# Altium schematic sheet functions.SchDoc
size 594 x 420 mm; Нач. отд.: Нач. отд.; Фамилия нач. отд.: Сидоров; Address1: Address1; Address2: Address2; Address3: Address3; Address4: Address4; SheetNumber: 1; Scale: 1:1; Обозначение документа: АБВГ.123456.001Э3; Наименование организации: ОАО "Ваша фирма"; Перв. применение: АБВГ.123456.000; Наименование изделия 1: Плата; Наименование изделия 2: Схема электрическая; Наименование изделия 3: принципиальная
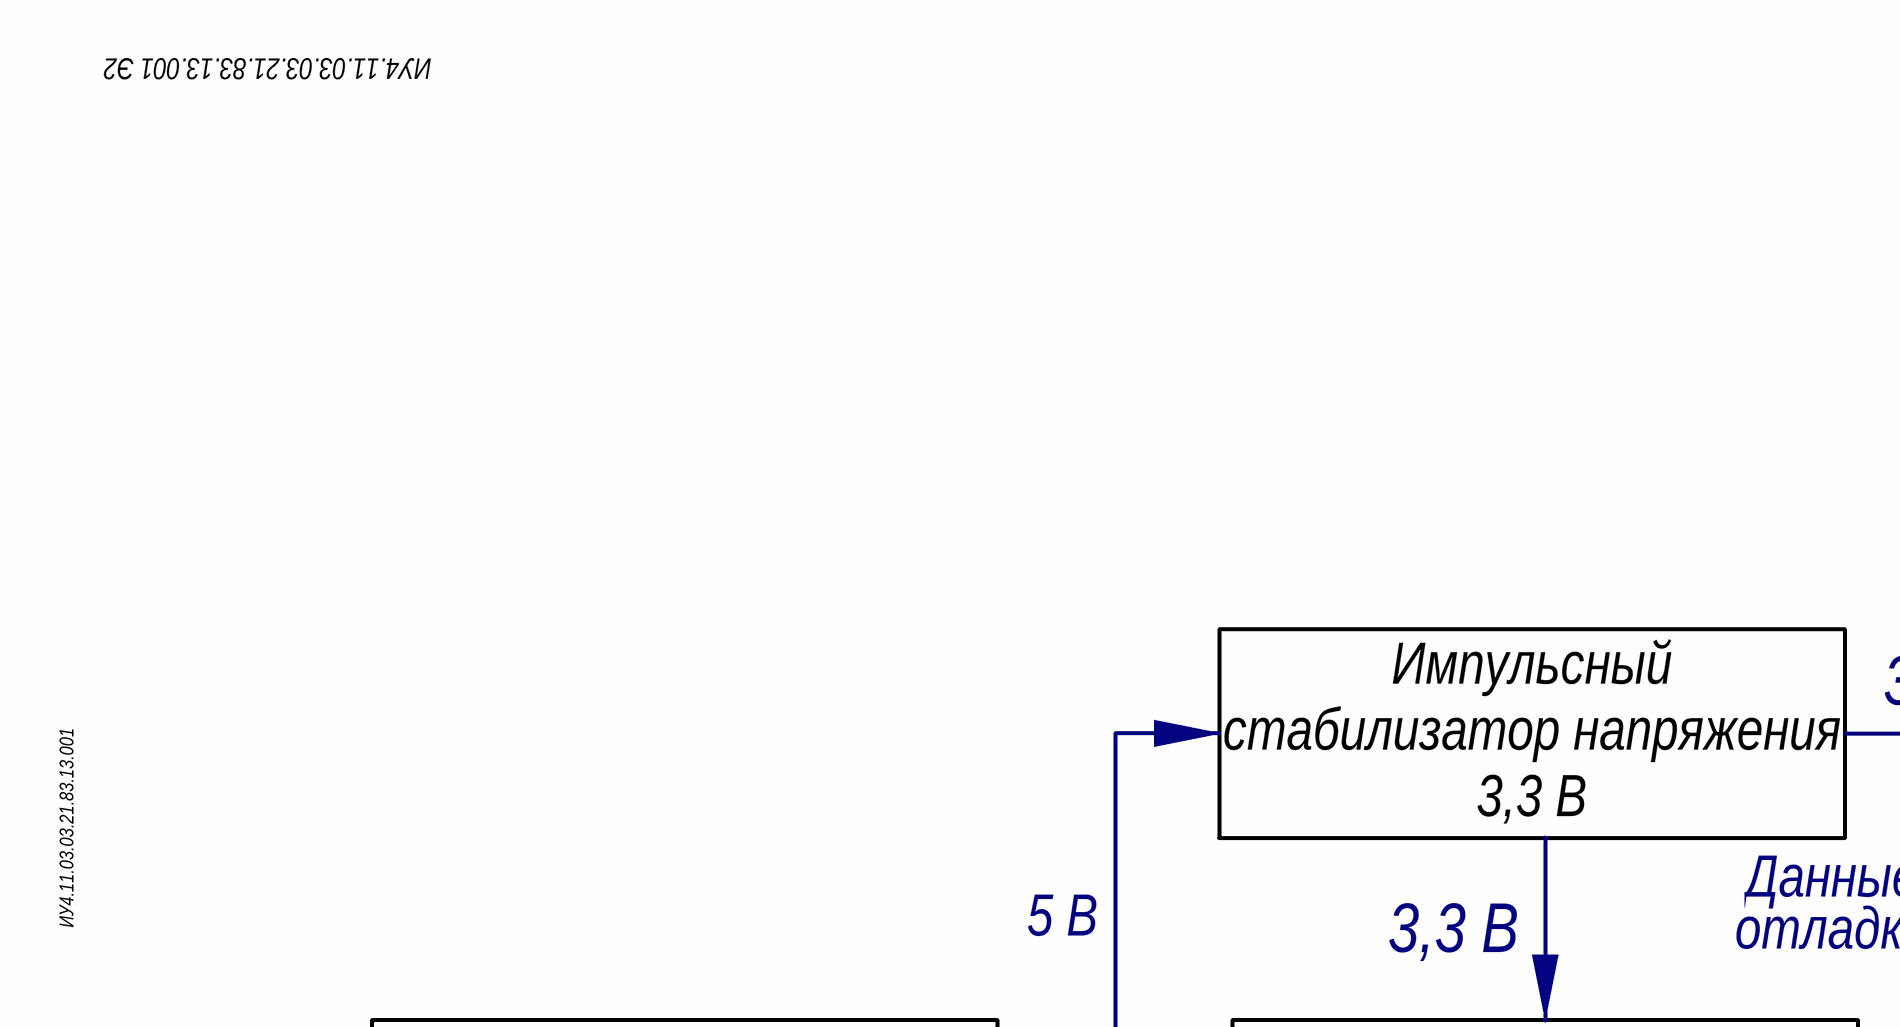
[diagram p0: functions.SchDoc, top left]
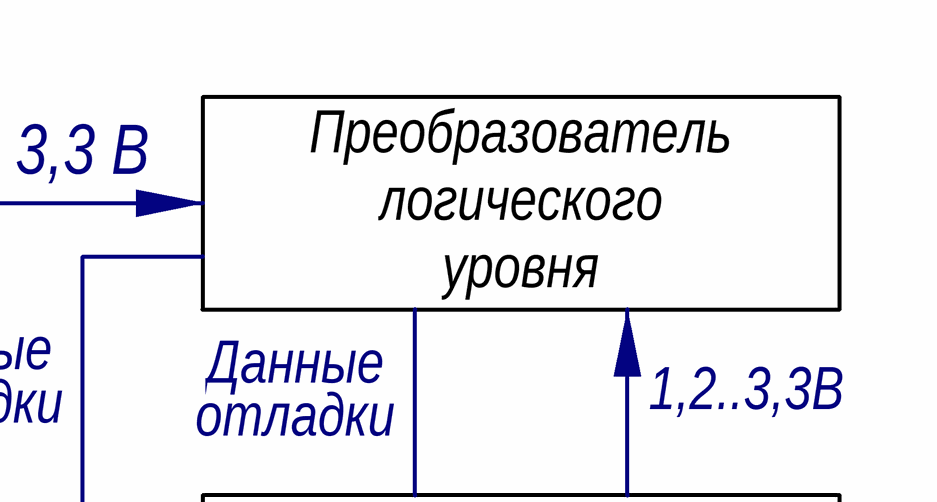
[diagram p1: functions.SchDoc, top right]
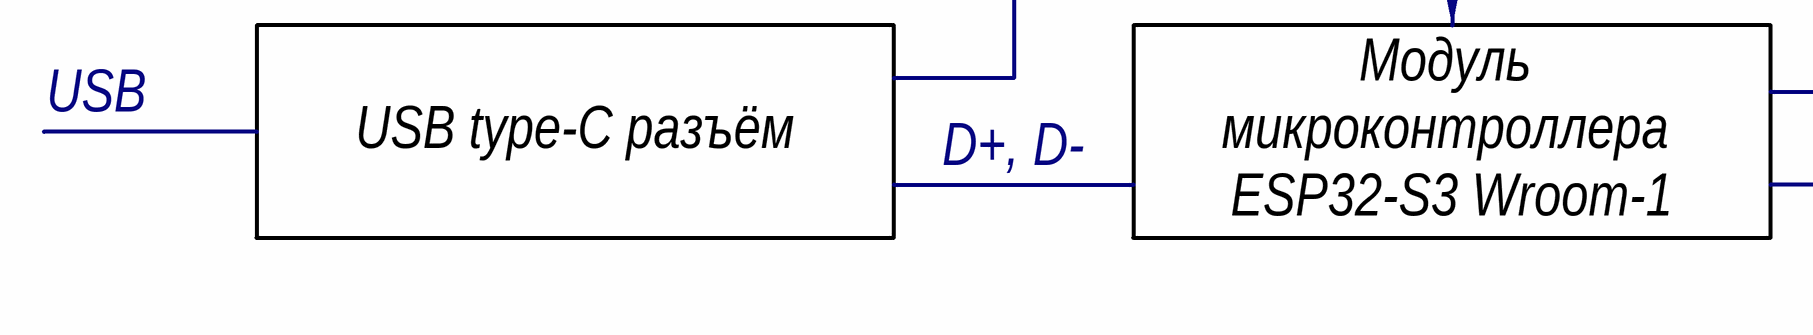
[diagram p2: functions.SchDoc, bottom left]
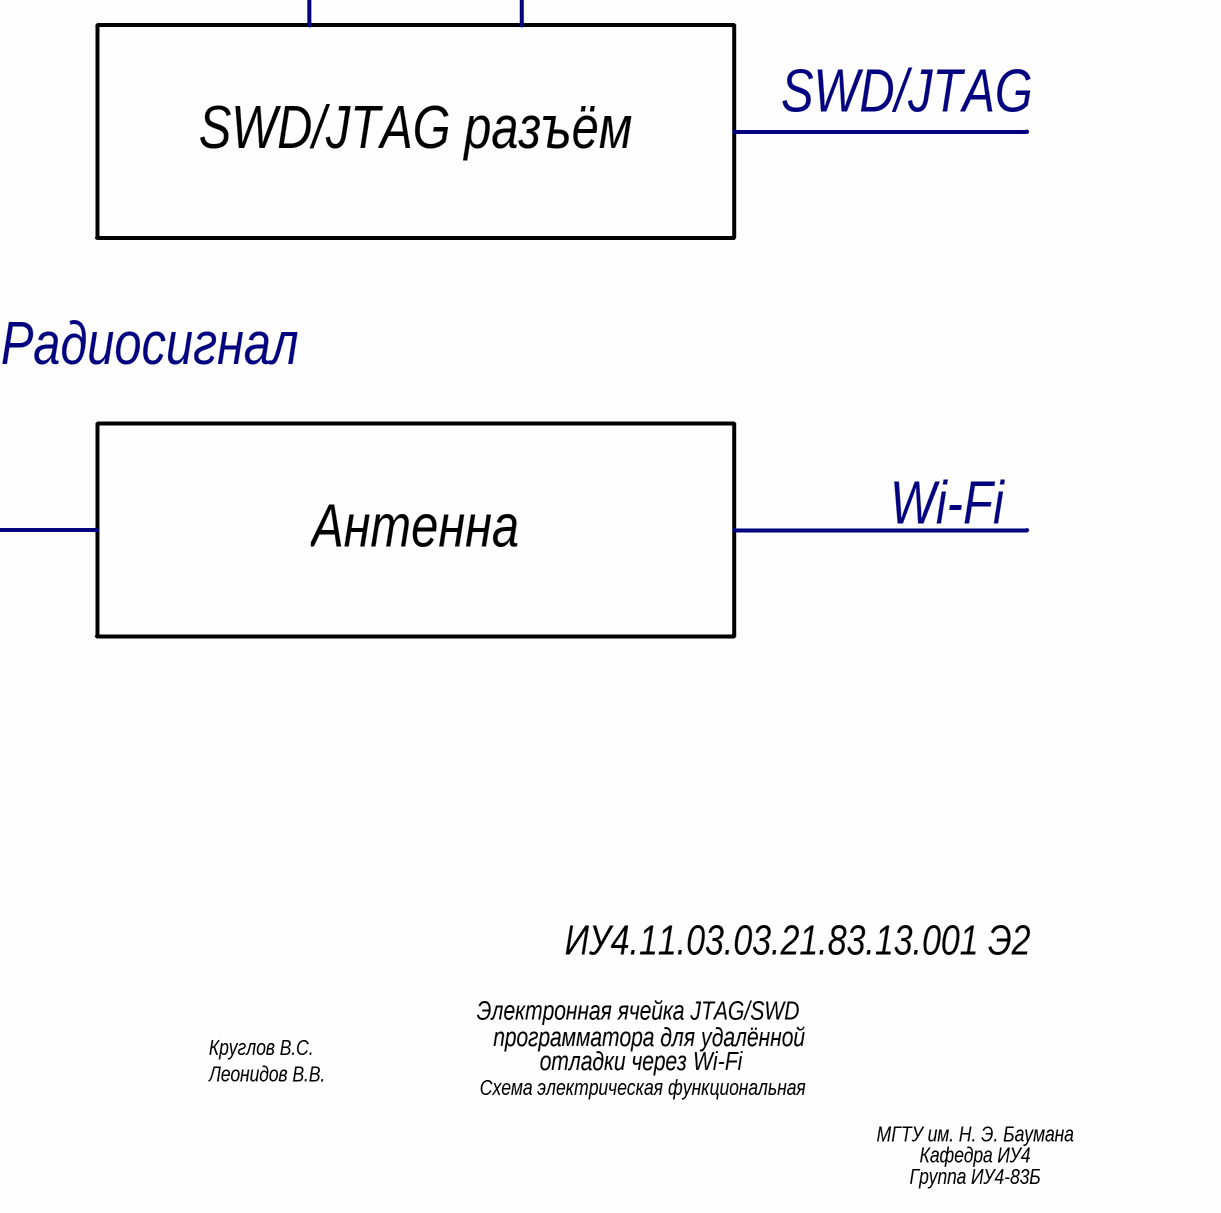
[diagram p3: functions.SchDoc, bottom right]

## Notes on the sheet
- ИУ4.11.03.03.21.83.13.001 Э2
- 3,3 В
- ИУ4.11.03.03.21.83.13.001
- Импульсный стабилизатор напряжения 3,3 В
- Данные
- Преобразователь
  логического
  уровня
- 5 В
- отладки
- 1,2..3,3В
- USB
- SWD/JTAG
- D+, D-
- USB type-С разъём
- Модуль
  микроконтроллера
  ESP32-S3 Wroom-1
- SWD/JTAG разъём
- Радиосигнал
- Wi-Fi
- Антенна
- Электронная ячейка JTAG/SWD
- Круглов В.С.
- Леонидов В.В.
- Схема электрическая функциональная
- отладки через Wi-Fi
- программатора для удалённой
- МГТУ им. Н. Э. Баумана
- Кафедра ИУ4
- Группа ИУ4-83Б
- Перв. примен.
- Справ. №
- Подп. и дата
- Инв. № дубл.
- Взам. инв. №
- Разраб.
- Изм.
- Лист
- № докум.
- Подп.
- Дата
- Лит.
- Масса
- Масштаб
- Пров.
- Т. контр.
- Листов
- 1
- Инв. № подл.
- Н. контр.
- Утв.
- Копировал
- Формат А2